# Altium schematic sheet LPEDT_revA1_bikeit_MCU_IO.SchDoc: MCU I/O
size A3; Author: Dhruva Koley; DocumentNumber: 8; Revision: 1; SheetNumber: 4; SheetTotal: 4
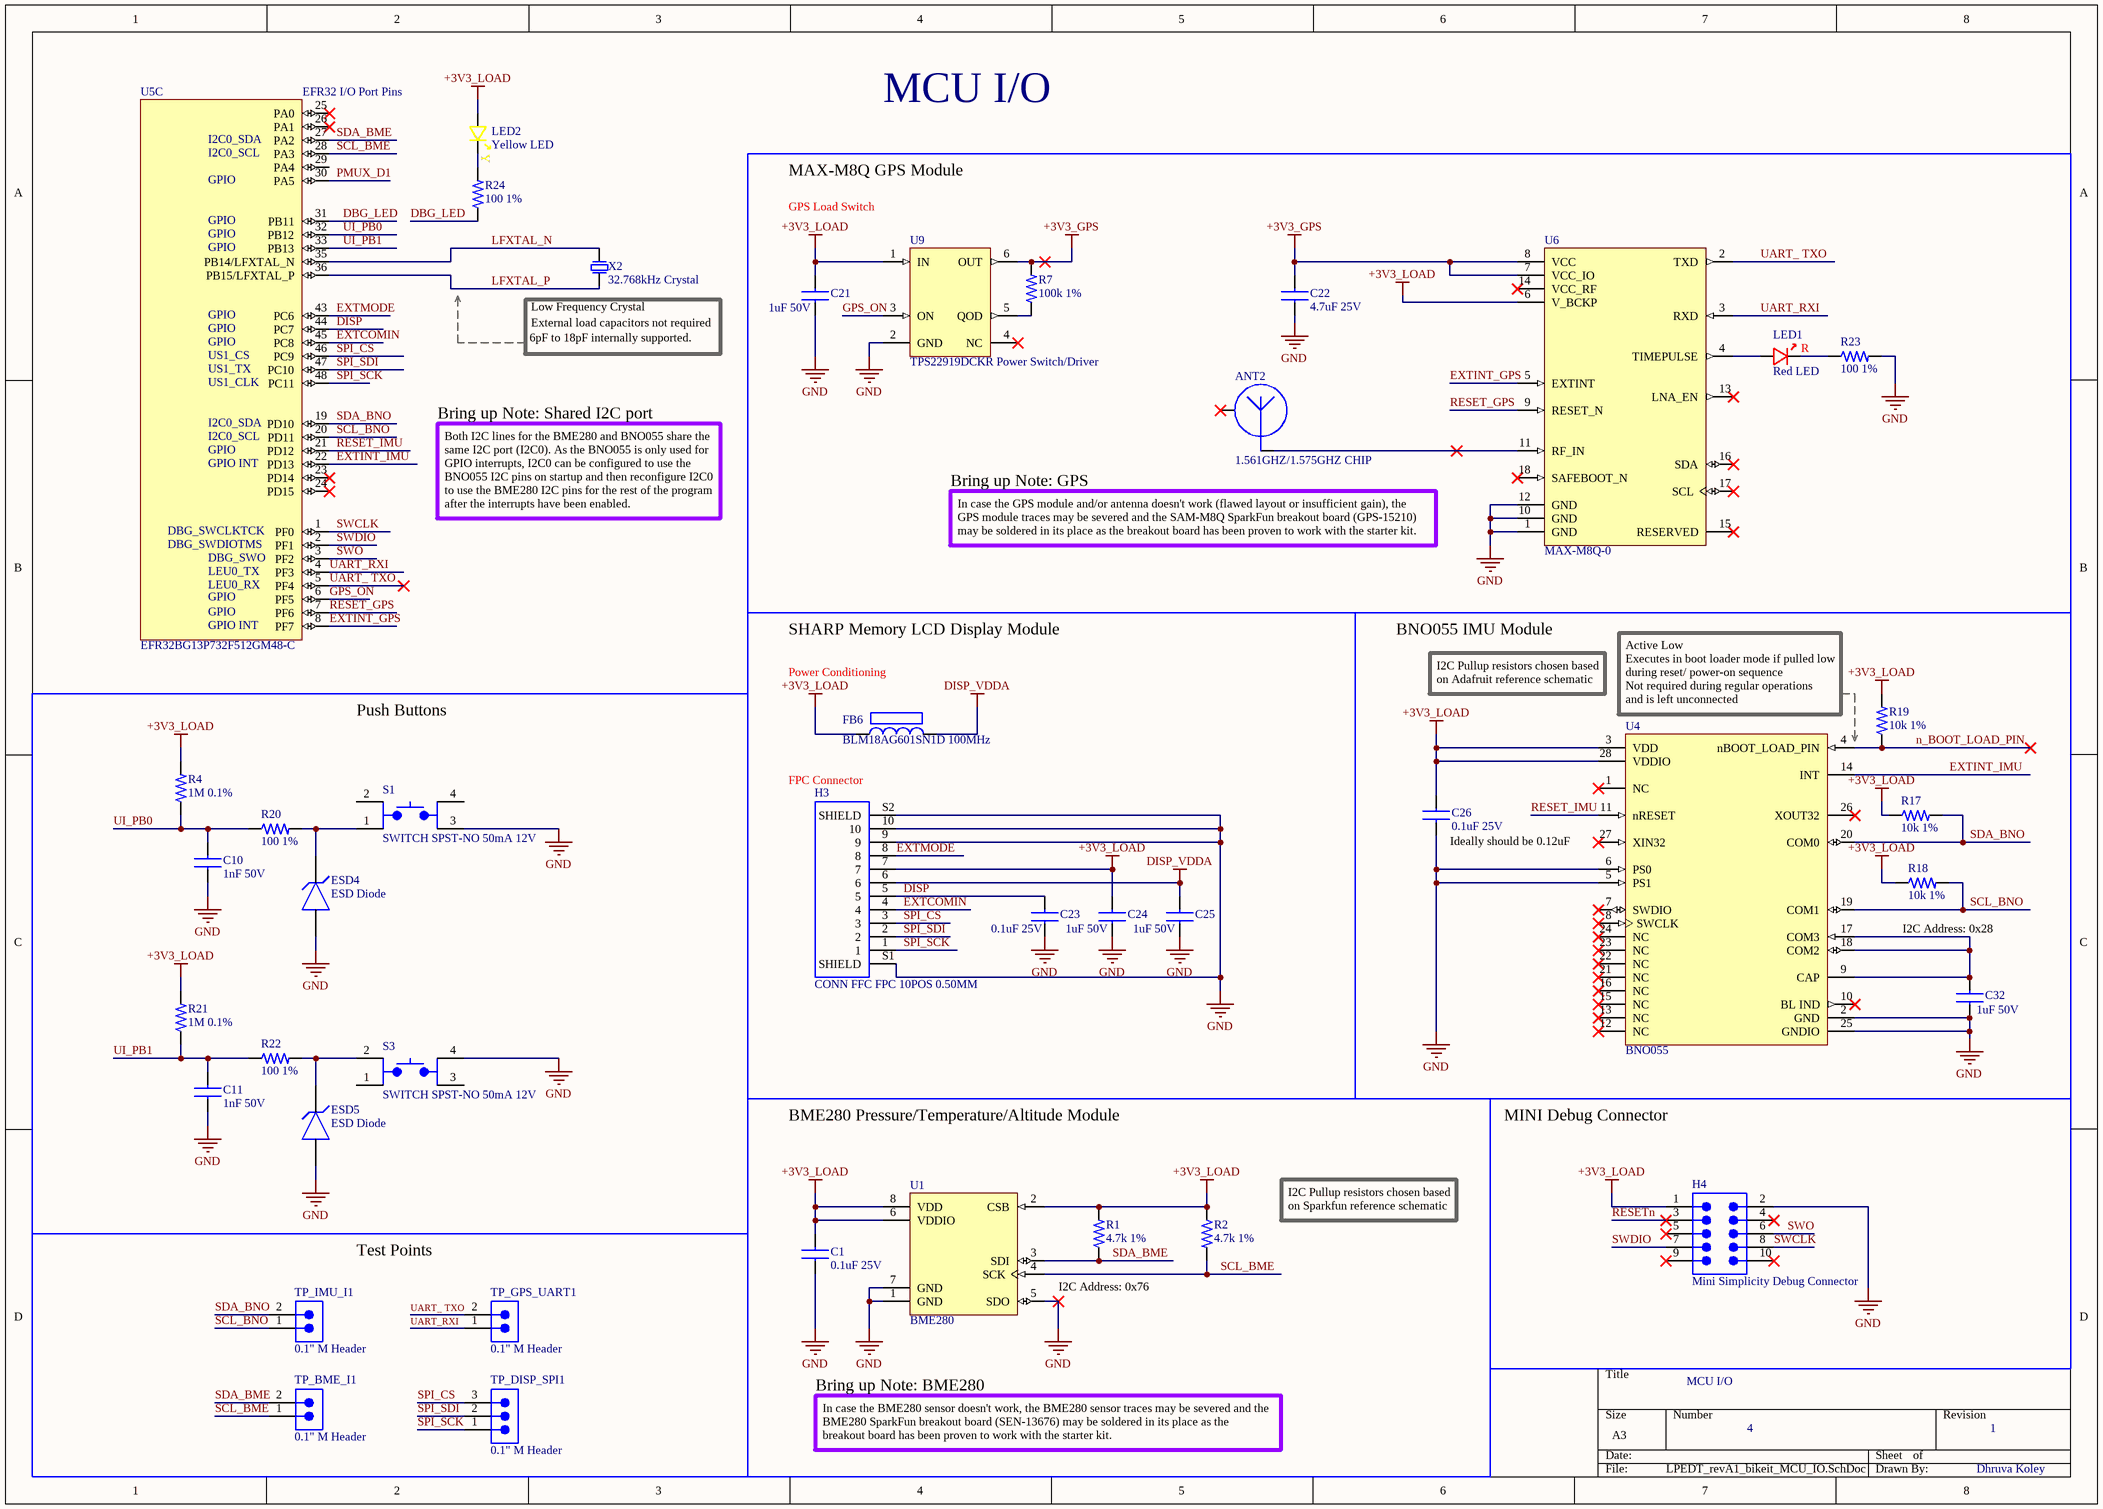
[diagram p0: LPEDT_revA1_bikeit_MCU_IO.SchDoc]

## Parts
ANT2  1.561GHZ/1.575GHZ CHIP  [CHIP_ANTENNA]
C1  0.1uF 25V  [CAP_0603_1.60mm*0.80mm]
C10  1nF 50V  [CAP_0603_1.60mm*0.80mm]
C11  1nF 50V  [CAP_0603_1.60mm*0.80mm]
C21  1uF 50V  [CAP_0603_1.60mm*0.80mm]
C22  4.7uF 25V  [CAP_0603_1.60mm*0.80mm]
C23  0.1uF 25V  [CAP_0603_1.60mm*0.80mm]
C24  1uF 50V  [CAP_0603_1.60mm*0.80mm]
C25  1uF 50V  [CAP_0603_1.60mm*0.80mm]
C26  0.1uF 25V  [CAP_0603_1.60mm*0.80mm]
C32  1uF 50V  [CAP_0603_1.60mm*0.80mm]
ESD4  ESD Diode  [ESD_SOD882]
ESD5  ESD Diode  [ESD_SOD882]
FB6  BLM18AG601SN1D 100MHz  [FB_Chip2PinSM127P600-8N]
H3  CONN FFC FPC 10POS 0.50MM  [FPC_AYF531035A]
H4  Mini Simplicity Debug Connector  [FTSH-105-01-XXX-DV-K]
LED1  Red LED  [LED_0603_RED_WL-SMCW]
LED2  Yellow LED  [LED_0603_YLW_WL-SMCW]
R1  4.7k 1%  [RES_0603_1608X06]
R2  4.7k 1%  [RES_0603_1608X06]
R4  1M 0.1%  [RES_0603_1608X06]
R7  100k 1%  [RES_0603_1608X06]
R17  10k 1%  [RES_0603_1608X06]
R18  10k 1%  [RES_0603_1608X06]
R19  10k 1%  [RES_0603_1608X06]
R20  100 1%  [RES_0603_1608X06]
R21  1M 0.1%  [RES_0603_1608X06]
R22  100 1%  [RES_0603_1608X06]
R23  100 1%  [RES_0603_1608X06]
R24  100 1%  [RES_0603_1608X06]
S1  SWITCH SPST-NO 50mA 12V  [SW_TL3305AF260QG]
S3  SWITCH SPST-NO 50mA 12V  [SW_TL3305AF260QG]
TP_BME_I1  0.1" M Header  [2-PIN_MALE_NO 3D]
TP_DISP_SPI1  0.1" M Header  [3-PIN_MALE_NO 3D]
TP_GPS_UART1  0.1" M Header  [2-PIN_MALE_NO 3D]
TP_IMU_I1  0.1" M Header  [2-PIN_MALE_NO 3D]
U1  BME280  [BME280_PSON65P250X250X100-8N]
U4  BNO055  [BNO055-MFG]
U5  EFR32BG13P732F512GM48-C  [MCU_QFN50P700X700X90_HS-49N]  (part C of 3)
U6  MAX-M8Q-0  [XCVR_MAX-M8C-0-10]
U9  TPS22919DCKR Power Switch/Driver  [LS_SOT65P210X110-6N]
X2  32.768kHz Crystal  [SMD_2 Crystal]

## Blocks framed on the sheet
Push Buttons: C10 C11 ESD4 ESD5 R4 R20-R22 S1 S3
MINI Debug Connector: H4
Test Points: TP_BME_I1 TP_DISP_SPI1 TP_GPS_UART1 TP_IMU_I1

## Nets
+3V3_GPS: C22.1 R7.2 U6.7(VCC_IO) U6.8(VCC) U9.6(OUT)
+3V3_LOAD: C1.1 C21.1 C24.1 C26.1 FB6.1 H3.7 H4.1 LED2.A R1.2 R2.1 R4.2 R17.1 R18.1 R19.2 R21.2 U1.2(CSB) U1.6(VDDIO) U1.8(VDD) U4.3(VDD) U4.28(VDDIO) U6.6(V_BCKP) U9.1(IN)
DISP_VDDA: C25.1 FB6.2 H3.6
GND: C1.2 C10.2 C11.2 C21.2 C22.2 C23.2 C24.2 C25.2 C26.2 C32.2 ESD4.2 ESD5.2 H3.9 H3.10 H3.S1(SHIELD) H3.S2(SHIELD) H4.2 R23.2 S1.3 S3.4 U1.1(GND) U1.5(SDO) U1.7(GND) U4.2(GND) U4.5(PS1) U4.6(PS0) U4.25(GNDIO) U6.1(GND) U6.10(GND) U6.12(GND) U9.2(GND)
DBG_LED: R24.1 U5.31(PB11)
DISP: C23.1 H3.5 U5.44(PC7)
EXTCOMIN: H3.4 U5.45(PC8)
EXTINT_GPS: U5.8(PF7) U6.5(EXTINT)
EXTINT_IMU: U4.14(INT) U5.22(PD13)
EXTMODE: H3.8 U5.43(PC6)
GPS_ON: U5.6(PF5) U9.3(ON)
LFXTAL_N: U5.35(PB14/LFXTAL_N) X2.2
LFXTAL_P: U5.36(PB15/LFXTAL_P) X2.1
n_BOOT_LOAD_PIN: R19.1 U4.4(nBOOT_LOAD_PIN)
PMUX_D1: U5.30(PA5)
RESET_GPS: U5.7(PF6) U6.9(RESET_N)
RESET_IMU: U4.11(nRESET) U5.21(PD12)
RESETn: H4.3
SCL_BME: R2.2 TP_BME_I1.1 U1.4(SCK) U5.28(PA3)
SCL_BNO: R18.2 TP_IMU_I1.1 U4.19(COM1) U5.20(PD11)
SDA_BME: R1.1 TP_BME_I1.2 U1.3(SDI) U5.27(PA2)
SDA_BNO: R17.2 TP_IMU_I1.2 U4.20(COM0) U5.19(PD10)
SPI_CS: H3.3 TP_DISP_SPI1.3 U5.46(PC9)
SPI_SCK: H3.1 TP_DISP_SPI1.1 U5.48(PC11)
SPI_SDI: H3.2 TP_DISP_SPI1.2 U5.47(PC10)
SWCLK: H4.8 U5.1(PF0)
SWDIO: H4.7 U5.2(PF1)
SWO: H4.6 U5.3(PF2)
UART_ TXO: TP_GPS_UART1.2 U5.5(PF4) U6.2(TXD)
UART_RXI: TP_GPS_UART1.1 U5.4(PF3) U6.3(RXD)
UI_PB0: C10.1 R4.1 R20.1 U5.32(PB12)
UI_PB1: C11.1 R21.1 R22.1 U5.33(PB13)
NetANT2_1: ANT2.1(FEED) U6.11(RF_IN)
NetC32_1: C32.1 U4.9(CAP) U4.17(COM3) U4.18(COM2)
NetESD4_1: ESD4.1 R20.2 S1.1
NetESD5_1: ESD5.1 R22.2 S3.2
NetLED1_A: LED1.A U6.4(TIMEPULSE)
NetLED1_C: LED1.C R23.1
NetLED2_C: LED2.C R24.2
NetR7_1: R7.1 U9.5(QOD)

Not connected (* = marked no-connect by the designer): ANT2 2(NC)*; H4 4* 5* 9* 10*; S1 2 4; S3 1 3; U4 1(NC)* 7(SWDIO)* 8(SWCLK)* 10(BL_IND)* 12(NC)* 13(NC)* 15(NC)* 16(NC)* 21(NC)* 22(NC)* 23(NC)* 24(NC)* 26(XOUT32)* 27(XIN32)*; U5 23(PD14)* 24(PD15)* 25(PA0)* 26(PA1)* 29(PA4); U6 13(LNA_EN)* 14(VCC_RF)* 15(RESERVED)* 16(SDA)* 17(SCL)* 18(SAFEBOOT_N)*; U9 4(NC)*

## Notes on the sheet
- (near U5) I2C0_SDA
- (near U5) I2C0_SCL
- GPIO
- MAX-M8Q GPS Module
- GPS Load Switch
- (near X2) Low Frequency Crystal
- US1_TX
- US1_CS
- 6pF to 18pF internally supported.
- External load capacitors not required
- (near U5) US1_CLK
- Bring up Note: Shared I2C port
- Both I2C lines for the BME280 and BNO055 share the
- same I2C port (I2C0). As the BNO055 is only used for
- (near U5) GPIO INT
- GPIO interrupts, I2C0 can be configured to use the
- BNO055 I2C pins on startup and then reconfigure I2C0
- to use the BME280 I2C pins for the rest of the program
- after the interrupts have been enabled.
- Bring up Note: GPS
- (near U6) In case the GPS module and/or antenna doesn't work (flawed layout or insufficient gain), the
- DBG_SWCLKTCK
- DBG_SWDIOTMS
- (near U5) DBG_SWO
- (near U5) LEU0_TX
- (near U5) LEU0_RX
- GPS module traces may be severed and the SAM-M8Q SparkFun breakout board (GPS-15210)
- (near U6) may be soldered in its place as the breakout board has been proven to work with the starter kit.
- SHARP Memory LCD Display Module
- BNO055 IMU Module
- Active Low
- Power Conditioning
- I2C Pullup resistors chosen based
- on Adafruit reference schematic
- (near R19) Executes in boot loader mode if pulled low
- during reset/ power-on sequence
- (near R19) Not required during regular operations
- (near U4) and is left unconnected
- FPC Connector
- Ideally should be 0.12uF
- I2C Address: 0x28
- BME280 Pressure/Temperature/Altitude Module
- on Sparkfun reference schematic
- I2C Address: 0x76
- Bring up Note: BME280
- In case the BME280 sensor doesn't work, the BME280 sensor traces may be severed and the
- BME280 SparkFun breakout board (SEN-13676) may be soldered in its place as the
- breakout board has been proven to work with the starter kit.
- (in symbol 150060RS75000) R
- (in symbol 150060YS75000) Y
- (in symbol EFR32BG13P732F512GM48-C, part C) EFR32 I/O Port Pins

## Library data of the parts
ANT2 = 1575AT43A0040E: RF ANT 1.561GHZ/1.575GHZ CHIP; Manufacturer: Johanson; Bandwidth: 40MHz; Impedance: 50R; Power Rating: 3W; Number of Bands: 1; Return Loss: -9.5dB; Gain: -2.5dB; Supplier 1: Digi-Key; Manufacturer Part Number: 1575AT43A0040E; RoHS: Yes; Category: RF Antennas; Stock 1: 56; Pricing 1: 1=0.84000, 10=0.75200, 25=0.71400, 100=0.58650, 250=0.54824, 500=0.48450 (USD); Mount: Surface Mount; Case/Package: SMD/SMT; Number of Pins: 2; Min Operating Temperature: -40°C; Max Operating Temperature: 85°C; Packaging: Tape and Reel; Package Quantity: 1; Max Power Dissipation: 3W; Termination: Solder; Frequency: 1.575GHz; Length: 7mm; Width: 2mm; Height: 0.031inch; Lead Free: Lead Free; ComponentLink1URL: https://datasheet.ciiva.com/2792/jti-antenna-1575at43a40-2006-09-2792227.pdf?src-supplier=Digi-Key; ComponentLink1Description: https://datasheet.ciiva.com/2792/jti-antenna-1575at43a40-2006-09-2792227.pdf?src-supplier=Digi-Key; ComponentLink2URL: https://datasheet.ciiva.com/24048/antenna-1575at43a0040-258086-24048619.pdf?src-supplier=Mouser; ComponentLink2Description: https://datasheet.ciiva.com/24048/antenna-1575at43a0040-258086-24048619.pdf?src-supplier=Mouser; ComponentLink3URL: https://datasheet.ciiva.com/4172/antenna-1575at43a0040-4172807.pdf?src-supplier=Arrow+Electronics; ComponentLink3Description: https://datasheet.ciiva.com/4172/antenna-1575at43a0040-4172807.pdf?src-supplier=Arrow+Electronics; Supplier Part Number 1: 712-1003-1-ND
C1 C23 C26 = GCJ188R71E104KA12D: CAP CER 0.1UF 25V X7R 0603; Manufacturer: Murata; Capacitance: 100nF; Tolerance: 10%; Supplier 1: Mouser; Manufacturer Part Number: GCJ188R71E104KA12D; RoHS: Yes; Category: Ceramic Capacitors; Stock 1: 1672; Pricing 1: 1=0.21000, 10=0.14900, 50=0.08480, 100=0.07030, 500=0.04928, 1000=0.04080 (USD); Mount: Surface Mount; Case/Package: 0603; Case Code (Imperial): 0603; Case Code (Metric): 1608; Min Operating Temperature: -55°C; Max Operating Temperature: 125°C; Features: Soft Termination; Packaging: Tape and Reel; Voltage Rating: 25V; Ratings: AEC-Q200; RoHS Compliant: Yes; ComponentLink1URL: http://search.murata.co.jp/Ceramy/image/img/A01X/G101/ENG/GCJ188R71E104KA12-01.pdf?src-supplier=Digi-Key; ComponentLink1Description: http://search.murata.co.jp/Ceramy/image/img/A01X/G101/ENG/GCJ188R71E104KA12-01.pdf?src-supplier=Digi-Key; Supplier Part Number 1: 81-GCJ188R71E104KA2D
C10 C11 = CL10B102KB8NNNC: Cap Ceramic 0.001uF 50V X7R 10% Pad SMD 0603 125°C T/R; Manufacturer: Samsung; Supplier 1: Digi-Key; Manufacturer Part Number: CL10B102KB8NNNC; RoHS: Yes; Category: Ceramic Capacitors; Stock 1: 2467621; Pricing 1: 4000=0.00643, 8000=0.00587 (USD); Mount: Surface Mount; Case/Package: 0603; Case Code (Metric): 1608; Case Code (Imperial): 0603; Material: Ceramic; Contact Plating: Tin; Min Operating Temperature: -55°C; Max Operating Temperature: 125°C; Tolerance: 10%; Package Quantity: 1; Packaging: Tape and Reel; Capacitance: 1nF; Voltage Rating: 50V; Dielectric: X7R; Voltage: 50V; Voltage Rating (DC): 50V; Series: CL; Construction: Flat; Length: 1.6mm; Width: 0.031inch; Height: 0.8mm; Thickness: 0.035inch; Depth: 0.8mm; Radiation Hardening: No; Lead Free: Lead Free; RoHS Compliant: Yes; ComponentLink1URL: https://datasheet.ciiva.com/25805/cl10b102kb8nnnc-25805137.pdf?src-supplier=Digi-Key; ComponentLink1Description: https://datasheet.ciiva.com/25805/cl10b102kb8nnnc-25805137.pdf?src-supplier=Digi-Key; ComponentLink2URL: https://datasheet.ciiva.com/15216/getdatasheetpartid-359690-15216231.pdf?src-supplier=Verical; ComponentLink2Description: https://datasheet.ciiva.com/15216/getdatasheetpartid-359690-15216231.pdf?src-supplier=Verical; ComponentLink3URL: https://datasheet.ciiva.com/29198/458300-da-01-en-vs-kondensator-0603-29198498.pdf?src-supplier=Conrad; ComponentLink3Description: https://datasheet.ciiva.com/29198/458300-da-01-en-vs-kondensator-0603-29198498.pdf?src-supplier=Conrad; ComponentLink4URL: https://datasheet.ciiva.com/16199/cl05b104kq5nnnc-16199064.pdf?src-supplier=Future+Electronics; ComponentLink4Description: https://datasheet.ciiva.com/16199/cl05b104kq5nnnc-16199064.pdf?src-supplier=Future+Electronics; ComponentLink5URL: https://datasheet.ciiva.com/26310/mlcc-catalogdownload2013-eng-26310326.pdf?src-supplier=Distrelec; ComponentLink5Description: https://datasheet.ciiva.com/26310/mlcc-catalogdownload2013-eng-26310326.pdf?src-supplier=Distrelec; Supplier Part Number 1: 1276-1018-2-ND
C21 C24 C25 C32 = GRT188R61H105KE13D: CAP, MLCC, AEC-Q200, X5R, 1uF, 50V, 0603; Manufacturer: Murata; Tolerance: 10%; Supplier 1: Digi-Key; Manufacturer Part Number: GRT188R61H105KE13D; RoHS: Yes; Category: Ceramic Capacitors; Stock 1: 645268; Pricing 1: 1=0.26000, 10=0.17900, 50=0.10720, 100=0.09060, 500=0.06198, 1000=0.05483 (USD); Mount: Surface Mount; Case/Package: 0603; Case Code (Metric): 1608; Case Code (Imperial): 0603; Min Operating Temperature: -55°C; Max Operating Temperature: 85°C; Packaging: Tape and Reel; Capacitance: 1uF; Voltage Rating: 50V; Dielectric: X5R; Voltage Rating (DC): 50V; Length: 0.063inch; Width: 0.031inch; Thickness: 0.035inch; Ratings: AEC-Q200; RoHS Compliant: Yes; ComponentLink1URL: http://www.farnell.com/datasheets/2165959.pdf?src-supplier=Farnell; ComponentLink1Description: http://www.farnell.com/datasheets/2165959.pdf?src-supplier=Farnell; ComponentLink2URL: http://search.murata.co.jp/Ceramy/image/img/A01X/G101/ENG/GRT188R61H105KE13-01.pdf?src-supplier=Digi-Key; ComponentLink2Description: http://search.murata.co.jp/Ceramy/image/img/A01X/G101/ENG/GRT188R61H105KE13-01.pdf?src-supplier=Digi-Key; ComponentLink3URL: https://search.murata.co.jp/Ceramy/image/img/A01X/G101/ENG/GRT188R61H105KE13-01.pdf?src-supplier=Digi-Key; ComponentLink3Description: https://search.murata.co.jp/Ceramy/image/img/A01X/G101/ENG/GRT188R61H105KE13-01.pdf?src-supplier=Digi-Key; ComponentLink4URL: http://www.farnell.com/datasheets/2165959.pdf?src-supplier=Newark; ComponentLink4Description: http://www.farnell.com/datasheets/2165959.pdf?src-supplier=Newark; Supplier Part Number 1: 490-12330-1-ND
C22 = GRM188R61E475KE11D: Cap Ceramic 0603 4.7 uF 25 V ±10 % Tolerance X5R SMT Multilayer Ceramic Capacitor; Manufacturer: Murata; Tolerance: 10%; Supplier 1: Digi-Key; Manufacturer Part Number: GRM188R61E475KE11D; RoHS: Yes; Category: Ceramic Capacitors; Stock 1: 307528; Pricing 1: 1=0.36000, 10=0.24700, 50=0.17280, 100=0.14820, 500=0.11112, 1000=0.09384 (USD); Mount: Surface Mount; Case/Package: 0603; Case Code (Metric): 1608; Case Code (Imperial): 0603; Material: Ceramic; Min Operating Temperature: -55°C; Max Operating Temperature: 85°C; Package Quantity: 4000; Packaging: Cut Tape; Capacitance: 4.7uF; Voltage Rating: 25V; Dielectric: X5R; Voltage: 25V; Voltage Rating (DC): 25V; Series: GRM; Length: 1.6mm; Width: 0.031inch; Height: 0.8mm; Thickness: 0.031inch; Depth: 0.8mm; REACH SVHC: No SVHC; Lead Free: Lead Free; RoHS Compliant: Yes; ComponentLink1URL: https://datasheet.ciiva.com/46444/1769893-46444982.pdf?src-supplier=Element14; ComponentLink1Description: https://datasheet.ciiva.com/46444/1769893-46444982.pdf?src-supplier=Element14; ComponentLink2URL: https://datasheet.ciiva.com/46444/1769893-46444983.pdf?src-supplier=Element14; ComponentLink2Description: https://datasheet.ciiva.com/46444/1769893-46444983.pdf?src-supplier=Element14; ComponentLink3URL: https://datasheet.ciiva.com/14891/partnumbering-e-01-14891103.pdf?src-supplier=Digi-Key; ComponentLink3Description: https://datasheet.ciiva.com/14891/partnumbering-e-01-14891103.pdf?src-supplier=Digi-Key; ComponentLink4URL: https://datasheet.ciiva.com/14891/partnumbering-e-01-14891102.pdf?src-supplier=Digi-Key; ComponentLink4Description: https://datasheet.ciiva.com/14891/partnumbering-e-01-14891102.pdf?src-supplier=Digi-Key; Supplier Part Number 1: 490-7203-1-ND
ESD4 ESD5 = SP1003-01ETG: ESD Suppressor Diode TVS Uni-Dir 5V Automotive 2-Pin SOD-882 T/R; Manufacturer: Littelfuse; Reverse Breakdown Voltage: 6V; Capacitance: 30pF; Max Surge Current: 7A; Number of Unidirectional Channels: 1; Clamping Voltage: 12V; Power Line Protection: No; Polarity: Bidirectional,Unidirectional; Test Current: 1mA; Leakage Current: 100nA; Diode Type: ZENER; Supplier 1: Digi-Key; Manufacturer Part Number: SP1003-01ETG; RoHS: Yes; Category: TVS Diodes; Stock 1: 9965; Pricing 1: 1=0.45000, 10=0.35100, 100=0.21040, 500=0.19478, 1000=0.13245, 2000=0.12193, 5000=0.11686 (USD); Mount: Surface Mount; Number of Pins: 2; Min Operating Temperature: -40°C; Max Operating Temperature: 85°C; Package Quantity: 3000; Packaging: Tape and Reel; Operating Supply Voltage: 5V; Reverse Standoff Voltage: 5V; Min Breakdown Voltage: 6V; Breakdown Voltage: 5V; Number of Channels: 1; Termination: SMD/SMT; Number of Elements: 1; Peak Pulse Current: 7A; Resistor Type: Zener; Series: Automotive, AEC-Q101, SP1003, SPA®; REACH SVHC: No SVHC; Lead Free: Lead Free; RoHS Compliant: Yes; ComponentLink1URL: https://datasheet.ciiva.com/4507/littelfuse-tvs-diode-array-spa-sp1003-221268-4507734.pdf?src-supplier=Mouser; ComponentLink1Description: https://datasheet.ciiva.com/4507/littelfuse-tvs-diode-array-spa-sp1003-221268-4507734.pdf?src-supplier=Mouser; ComponentLink2URL: https://datasheet.ciiva.com/16488/littelfuse-tvs-diode-array-spa-sp1003-16488471.pdf?src-supplier=Future+Electronics; ComponentLink2Description: https://datasheet.ciiva.com/16488/littelfuse-tvs-diode-array-spa-sp1003-16488471.pdf?src-supplier=Future+Electronics; ComponentLink3URL: https://datasheet.ciiva.com/330/littelfuse-tvs-diode-array-sp1003-datasheet-pdf-330594.pdf?src-supplier=Digi-Key; ComponentLink3Description: https://datasheet.ciiva.com/330/littelfuse-tvs-diode-array-sp1003-datasheet-pdf-330594.pdf?src-supplier=Digi-Key; ComponentLink4URL: https://datasheet.ciiva.com/330/littelfuse-tvs-diode-array-sp1003-datasheet-pdf-330595.pdf?src-supplier=Digi-Key; ComponentLink4Description: https://datasheet.ciiva.com/330/littelfuse-tvs-diode-array-sp1003-datasheet-pdf-330595.pdf?src-supplier=Digi-Key; ComponentLink5URL: https://datasheet.ciiva.com/330/littelfuse-tvs-diode-array-sp1003-datasheet-pdf-330596.pdf?src-supplier=Digi-Key; ComponentLink5Description: https://datasheet.ciiva.com/330/littelfuse-tvs-diode-array-sp1003-datasheet-pdf-330596.pdf?src-supplier=Digi-Key; ComponentLink6URL: https://datasheet.ciiva.com/1268/1854133-1268499.pdf?src-supplier=Element14; ComponentLink6Description: https://datasheet.ciiva.com/1268/1854133-1268499.pdf?src-supplier=Element14; Supplier Part Number 1: F4088CT-ND
FB6 = BLM18AG601SN1D: Ferrite Bead, 0603 / 1608, 600 ohm, 500 mA, Série BLM18A, 0.38 ohm, ± 25%; Manufacturer: Murata; Material: Steel,Ferrite; Impedance: 600R; Max Current Rating: 500mA; Number of Lines: 1; DC Resistance (DCR): 380mR; Shielding: Unshielded; Supplier 1: Digi-Key; Manufacturer Part Number: BLM18AG601SN1D; RoHS: Yes; Category: Inductors; Stock 1: 826617; Pricing 1: 1=0.10000, 10=0.07200, 25=0.06560, 50=0.05900, 100=0.04320, 250=0.03144, 500=0.02882, 1000=0.02489 (USD); Case/Package: 0603; Number of Pins: 2; Core Material: Ferrite; Case Code (Metric): 1608; Case Code (Imperial): 0603; Weight: 7.1E-05oz; Min Operating Temperature: -55°C; Max Operating Temperature: 125°C; Package Quantity: 1; Packaging: Tape and Reel; Frequency: 100MHz; Tolerance: 25%; Current Rating: 500mA; Termination: SMD/SMT; Max DC Current: 500mA; Test Frequency: 100MHz; DC Current: 500mA; Number of Circuits: 1; Length: 1.6mm; Width: 0.8mm; Height: 0.8mm; Depth: 0.8mm; Radiation Hardening: No; RoHS Compliant: Yes; Lead Free: Lead Free; REACH SVHC: No SVHC; Military Standard: Not; ComponentLink1URL: https://datasheet.ciiva.com/19460/1844766-19460213.pdf?src-supplier=Jameco; ComponentLink1Description: https://datasheet.ciiva.com/19460/1844766-19460213.pdf?src-supplier=Jameco; ComponentLink2URL: https://datasheet.ciiva.com/29347/442309-da-01-en-chip-drossel-0603-600r-500ma-1-6x0-8mm-29347900.pdf?src-supplier=Conrad; ComponentLink2Description: https://datasheet.ciiva.com/29347/442309-da-01-en-chip-drossel-0603-600r-500ma-1-6x0-8mm-29347900.pdf?src-supplier=Conrad; ComponentLink3URL: https://datasheet.ciiva.com/41449/001172228-da-01-en-drossel-0603-600r-1-6x0-8mm-4000st-41449517.pdf?src-supplier=Conrad; ComponentLink3Description: https://datasheet.ciiva.com/41449/001172228-da-01-en-drossel-0603-600r-1-6x0-8mm-4000st-41449517.pdf?src-supplier=Conrad; ComponentLink4URL: https://datasheet.ciiva.com/1012/l0110s0100blm18a-1012017.pdf?src-supplier=Digi-Key; ComponentLink4Description: https://datasheet.ciiva.com/1012/l0110s0100blm18a-1012017.pdf?src-supplier=Digi-Key; ComponentLink5URL: https://datasheet.ciiva.com/1012/l0110s0100blm18a-1012018.pdf?src-supplier=Digi-Key; ComponentLink5Description: https://datasheet.ciiva.com/1012/l0110s0100blm18a-1012018.pdf?src-supplier=Digi-Key; ComponentLink6URL: https://datasheet.ciiva.com/1012/l0110s0100blm18a-1012019.pdf?src-supplier=Digi-Key; ComponentLink6Description: https://datasheet.ciiva.com/1012/l0110s0100blm18a-1012019.pdf?src-supplier=Digi-Key; ComponentLink7URL: https://datasheet.ciiva.com/1466/1756147-1466933.pdf?src-supplier=Element14; ComponentLink7Description: https://datasheet.ciiva.com/1466/1756147-1466933.pdf?src-supplier=Element14; ComponentLink8URL: https://datasheet.ciiva.com/1466/1756147-1466934.pdf?src-supplier=Element14; ComponentLink8Description: https://datasheet.ciiva.com/1466/1756147-1466934.pdf?src-supplier=Element14; ComponentLink9URL: https://datasheet.ciiva.com/16210/l0110s0100blm18a-16210006.pdf?src-supplier=Future+Electronics; ComponentLink9Description: https://datasheet.ciiva.com/16210/l0110s0100blm18a-16210006.pdf?src-supplier=Future+Electronics; ComponentLink10URL: https://datasheet.ciiva.com/3081/l0110s0100blm18a-3081613.pdf?src-supplier=Avnet; ComponentLink10Description: https://datasheet.ciiva.com/3081/l0110s0100blm18a-3081613.pdf?src-supplier=Avnet; Supplier Part Number 1: 490-1014-1-ND
H3 = AYF531035A: 10 Position 0.5 mm Solder Right Angle FFC / FPC SMD Socket; Manufacturer: Panasonic; Actuator Material: Polymer,Liquid Crystal Polymer; Voltage Rating: 50V; Current Rating: 500mA; Number of Positions: 10; Pitch: 0.02inch; Manufacturer Part Number: AYF531035A; RoHS: Yes; Category: FFC / FPC; Stock 1: 2493; Pricing 1: 1=0.93000, 10=0.81600, 25=0.76800, 50=0.73600, 100=0.70400, 250=0.64000, 500=0.57600, 1000=0.51200, 2500=0.46400 (USD); Mount: Surface Mount; Contact Plating: Gold; Contact Material: Copper Alloy; Housing Material: Polymer; Min Operating Temperature: -55°C; Max Operating Temperature: 85°C; Package Quantity: 500; Packaging: Cut Strip; Termination: Solder; Lead Free: Lead Free; Flammability Rating: UL94 V-0; ComponentLink1URL: https://www3.panasonic.biz/ac/e_download/control/connector/fpc-ffc/catalog/con_eng_y5bw.pdf?src-supplier=Digi-Key; ComponentLink1Description: https://www3.panasonic.biz/ac/e_download/control/connector/fpc-ffc/catalog/con_eng_y5bw.pdf?src-supplier=Digi-Key; ComponentLink2URL: http://www3.panasonic.biz/ac/e_download/control/connector/fpc-ffc/catalog/con_eng_y5bw.pdf?src-supplier=Digi-Key; ComponentLink2Description: http://www3.panasonic.biz/ac/e_download/control/connector/fpc-ffc/catalog/con_eng_y5bw.pdf?src-supplier=Digi-Key; Supplier 1: Digi-Key; Supplier Part Number 1: 255-5667-ND
H4 = FTSH-105-01-LM-DV-K: Conn Unshrouded Header HDR 10 POS 1.27mm Solder ST SMD Tube; Manufacturer: Samtec; Gender: Male; Number of Contacts: 10; Supplier 1: Digi-Key; Manufacturer Part Number: FTSH-105-01-LM-DV-K; RoHS: Yes; Category: Connectors; Stock 1: 2459; Pricing 1: 1=2.93000, 10=2.81700, 100=2.34750, 500=1.99536, 1000=1.70192, 5000=1.52586 (USD); Housing Material: Polymer; Housing Color: Black; Contact Plating: Gold; Contact Material: Bronze; Min Operating Temperature: -55°C; Max Operating Temperature: 125°C; Orientation: Straight; Number of Rows: 2; Packaging: Rail/Tube; Termination: Solder; Length: 6.35mm; Pitch: 1.27mm; Depth: 3.43mm; Radiation Hardening: No; ComponentLink1URL: https://datasheet.ciiva.com/16689/ftsh-mt-16689356.pdf?src-supplier=Avnet+Europe; ComponentLink1Description: https://datasheet.ciiva.com/16689/ftsh-mt-16689356.pdf?src-supplier=Avnet+Europe; ComponentLink2URL: https://datasheet.ciiva.com/10245/ftsh-mt-10245149.pdf?src-supplier=Avnet; ComponentLink2Description: https://datasheet.ciiva.com/10245/ftsh-mt-10245149.pdf?src-supplier=Avnet; Supplier Part Number 1: SAM9441-ND
LED1 = 150060RS75000: WURTH ELEKTRONIK - 150060RS75000 - LED, Red, 625 nm, 2 V, 30 mA, 250 mcd RoHS Compliant: Yes; Manufacturer: Wurth Electronics; Viewing Angle: 140°; Lens Style: Clear,Rectangular; Luminous Intensity: 250mcd; Forward Current: 30mA; Forward Voltage: 2V; Wavelength: 625nm; Test Current: 20mA; Manufacturer Part Number: 150060RS75000; RoHS: Yes; Category: LEDs; Stock 1: 173130; Pricing 1: 1=0.14000, 50=0.13300, 100=0.11400, 500=0.09990 (USD); Mount: Surface Mount; Case/Package: 0603; Color: Red; Case Code (Metric): 1608; Case Code (Imperial): 0603; Min Operating Temperature: -40°C; Max Operating Temperature: 85°C; Package Quantity: 1; Packaging: Cut Tape; Dominant Wavelength: 625nm; Length: 1.6mm; Width: 0.8mm; Height: 0.7mm; REACH SVHC: Unknown; RoHS Compliant: Yes; ComponentLink1URL: https://datasheet.ciiva.com/29563/150060rs75000-29563040.pdf?src-supplier=Digi-Key; ComponentLink1Description: https://datasheet.ciiva.com/29563/150060rs75000-29563040.pdf?src-supplier=Digi-Key; ComponentLink2URL: https://datasheet.ciiva.com/29279/759428-da-01-en-chipled-0603-w-kl-rot-150060rs75000-29279196.pdf?src-supplier=Conrad; ComponentLink2Description: https://datasheet.ciiva.com/29279/759428-da-01-en-chipled-0603-w-kl-rot-150060rs75000-29279196.pdf?src-supplier=Conrad; Supplier 1: Digi-Key; Supplier Part Number 1: 732-4978-1-ND
LED2 = 150060YS75000: WURTH ELEKTRONIK - 150060YS75000 - LED, Yellow, SMD, 0603, 30 mA, 2 V, 590 nm; Manufacturer: Wurth Electronics; Viewing Angle: 140°; Lens Style: Clear,Rectangular; Wavelength: 590nm; Luminous Intensity: 120mcd; Forward Voltage: 2V; Forward Current: 30mA; Test Current: 20mA; Manufacturer Part Number: 150060YS75000; RoHS: Yes; Category: LEDs; Stock 1: 44523; Pricing 1: 1=0.14000, 50=0.13300, 100=0.11400, 500=0.09990 (USD); Mount: Surface Mount; Case/Package: 0603; Color: Yellow; Case Code (Metric): 1608; Case Code (Imperial): 0603; Min Operating Temperature: -40°C; Max Operating Temperature: 85°C; Package Quantity: 4000; Packaging: Tape and Reel; Dominant Wavelength: 590nm; Length: 1.6mm; Width: 0.8mm; Height: 0.7mm; REACH SVHC: Unknown; RoHS Compliant: Yes; ComponentLink1URL: https://datasheet.ciiva.com/23843/150060ys75000-23843250.pdf?src-supplier=Newark; ComponentLink1Description: https://datasheet.ciiva.com/23843/150060ys75000-23843250.pdf?src-supplier=Newark; ComponentLink2URL: https://datasheet.ciiva.com/29279/759432-da-01-en-chipled-0603-w-kl-gelb-150060ys75000-29279206.pdf?src-supplier=Conrad; ComponentLink2Description: https://datasheet.ciiva.com/29279/759432-da-01-en-chipled-0603-w-kl-gelb-150060ys75000-29279206.pdf?src-supplier=Conrad; ComponentLink3URL: https://datasheet.ciiva.com/29563/150060ys75000-29563045.pdf?src-supplier=Digi-Key; ComponentLink3Description: https://datasheet.ciiva.com/29563/150060ys75000-29563045.pdf?src-supplier=Digi-Key; ComponentLink4URL: https://datasheet.ciiva.com/22656/1911348-22656951.pdf?src-supplier=Element14; ComponentLink4Description: https://datasheet.ciiva.com/22656/1911348-22656951.pdf?src-supplier=Element14; ComponentLink5URL: https://datasheet.ciiva.com/29563/150060ys75000-29563033.pdf?src-supplier=Digi-Key; ComponentLink5Description: https://datasheet.ciiva.com/29563/150060ys75000-29563033.pdf?src-supplier=Digi-Key; ComponentLink6URL: https://datasheet.ciiva.com/48430/150060ys75000-eng-tds-48430044.pdf?src-supplier=Distrelec; ComponentLink6Description: https://datasheet.ciiva.com/48430/150060ys75000-eng-tds-48430044.pdf?src-supplier=Distrelec; Supplier 1: Digi-Key; Supplier Part Number 1: 732-4981-1-ND
R1 R2 = RC0603FR-074K7L: RES SMD 4.7k  1% 0603; Manufacturer: Yageo; Resistance: 4.7kR; Voltage Rating (DC): 50V; Temperature Coefficient: 100ppm/°C; Power Rating: 100mW; Supplier 1: Digi-Key; Manufacturer Part Number: RC0603FR-074K7L; RoHS: Yes; Category: Chip SMD Resistors; Stock 1: 3174335; Pricing 1: 1=0.10000, 10=0.02300, 100=0.00930, 1000=0.00417, 2500=0.00362 (USD); Case/Package: 0603; Number of Pins: 2; Case Code (Imperial): 0603; Case Code (Metric): 1608; Size Code: 0603; Min Operating Temperature: -55°C; Max Operating Temperature: 155°C; Packaging: Tape and Reel; Tolerance: 1%; Resistor Type: Thick Film; Voltage Rating: 50V; Termination: SMD/SMT; Features: Moisture Resistant; Series: RC; Max Power Dissipation: 100mW; Number of Terminations: 2; Construction: Rectangular; Resistance Tolerance: 1%; Length: 1.6mm; Width: 0.8mm; Height: 0.45mm; Depth: 0.8mm; Lead Pitch: 0.3mm; REACH SVHC: No SVHC; Lead Free: Lead Free; Military Standard: Not; RoHS Compliant: Yes; ComponentLink1URL: https://datasheet.ciiva.com/15189/getdatasheetpartid-422754-15189760.pdf?src-supplier=Verical; ComponentLink1Description: https://datasheet.ciiva.com/15189/getdatasheetpartid-422754-15189760.pdf?src-supplier=Verical; ComponentLink2URL: https://datasheet.ciiva.com/22747/443971-22747528.pdf?src-supplier=Element14; ComponentLink2Description: https://datasheet.ciiva.com/22747/443971-22747528.pdf?src-supplier=Element14; ComponentLink3URL: https://datasheet.ciiva.com/7660/38590-7660794.pdf?src-supplier=Element14; ComponentLink3Description: https://datasheet.ciiva.com/7660/38590-7660794.pdf?src-supplier=Element14; ComponentLink4URL: https://datasheet.ciiva.com/7746/1868787-7746365.pdf?src-supplier=Element14; ComponentLink4Description: https://datasheet.ciiva.com/7746/1868787-7746365.pdf?src-supplier=Element14; ComponentLink5URL: https://datasheet.ciiva.com/46440/1868787-46440909.pdf?src-supplier=Element14; ComponentLink5Description: https://datasheet.ciiva.com/46440/1868787-46440909.pdf?src-supplier=Element14; ComponentLink6URL: https://datasheet.ciiva.com/7746/1738695-7746366.pdf?src-supplier=Element14; ComponentLink6Description: https://datasheet.ciiva.com/7746/1738695-7746366.pdf?src-supplier=Element14; Supplier Part Number 1: 311-4.70KHRCT-ND
R4 R21 = CPF0603B1M0E1: Res Thin Film 0603 1M Ohm 0.1% 1/16W ±25ppm/°C Molded SMD SMD Paper T/R; Manufacturer: TE Connectivity Neohm; Resistance: 1MR; Max Power Dissipation: 63mW; Voltage Rating: 50V; Number of Resistors: 1; Supplier 1: Digi-Key; Manufacturer Part Number: CPF0603B1M0E1; RoHS: Yes; Category: Chip SMD Resistors; Stock 1: 104463; Pricing 1: 1=0.59000, 10=0.42100, 100=0.21890 (USD); Mount: Surface Mount; Case/Package: 0603; Case Code (Imperial): 0603; Case Code (Metric): 1608; Weight: 7.1E-05oz; Size Code: 0603; Min Operating Temperature: -55°C; Max Operating Temperature: 155°C; Packaging: Tape and Reel; Tolerance: 0.1%; Resistor Type: Thin Film; Package Quantity: 1000; Temperature Coefficient: 25ppm/°C; Number of Terminations: 2; Series: CPF, Neohm; Power Rating: 63mW; Termination: Solder; Voltage Rating (DC): 50V; Resistance Tolerance: 0.1%; Length: 1.55mm; Width: 0.8mm; Height: 0.45mm; Lead Free: Lead Free; RoHS Compliant: Yes; REACH SVHC: No SVHC; ELV: Compliant; ComponentLink1URL: https://datasheet.ciiva.com/12793/eng-ds-1773200-i-12793711.pdf?src-supplier=Mouser; ComponentLink1Description: https://datasheet.ciiva.com/12793/eng-ds-1773200-i-12793711.pdf?src-supplier=Mouser; ComponentLink2URL: https://datasheet.ciiva.com/22670/1723857-22670697.pdf?src-supplier=Element14; ComponentLink2Description: https://datasheet.ciiva.com/22670/1723857-22670697.pdf?src-supplier=Element14; ComponentLink3URL: https://datasheet.ciiva.com/46382/1723857-46382668.pdf?src-supplier=Element14; ComponentLink3Description: https://datasheet.ciiva.com/46382/1723857-46382668.pdf?src-supplier=Element14; Supplier Part Number 1: A102234CT-ND
R7 = RC0603FR-07100KL: RES SMD 100k  1% 1/10W 0603; Manufacturer: Yageo; Resistance: 100kR; Temperature Coefficient: 100ppm/°C; Voltage Rating (DC): 50V; Power Rating: 100mW; Working Voltage: 75V; Supplier 1: Digi-Key; Manufacturer Part Number: RC0603FR-07100KL; RoHS: Yes; Category: Chip SMD Resistors; Stock 1: 21765991; Pricing 1: 1=0.10000, 10=0.02300, 100=0.00930, 1000=0.00417, 2500=0.00362 (USD); Case/Package: 0603; Number of Pins: 2; Case Code (Imperial): 0603; Case Code (Metric): 1608; Min Operating Temperature: -55°C; Max Operating Temperature: 155°C; Tolerance: 1%; Packaging: Tape and Reel; Resistor Type: Thick Film; Voltage Rating: 50V; Termination: SMD/SMT; Number of Terminations: 2; Features: Moisture Resistant; Series: RC; Max Power Dissipation: 100mW; Resistance Tolerance: 1%; Construction: Rectangular; Technology: THICK FILM; Length: 1.6mm; Width: 0.8mm; Height: 0.45mm; Depth: 0.8mm; REACH SVHC: No SVHC; Lead Free: Lead Free; Military Standard: Not; RoHS Compliant: Yes; ComponentLink1URL: https://datasheet.ciiva.com/11808/0900766b80f96399-11808107.pdf?src-supplier=RSComponents; ComponentLink1Description: https://datasheet.ciiva.com/11808/0900766b80f96399-11808107.pdf?src-supplier=RSComponents; ComponentLink2URL: https://datasheet.ciiva.com/46440/1868787-46440889.pdf?src-supplier=Element14; ComponentLink2Description: https://datasheet.ciiva.com/46440/1868787-46440889.pdf?src-supplier=Element14; ComponentLink3URL: https://datasheet.ciiva.com/7746/1738695-7746234.pdf?src-supplier=Element14; ComponentLink3Description: https://datasheet.ciiva.com/7746/1738695-7746234.pdf?src-supplier=Element14; ComponentLink4URL: https://datasheet.ciiva.com/7983/443971-7983593.pdf?src-supplier=Element14; ComponentLink4Description: https://datasheet.ciiva.com/7983/443971-7983593.pdf?src-supplier=Element14; ComponentLink5URL: https://datasheet.ciiva.com/7746/1738695-7746235.pdf?src-supplier=Element14; ComponentLink5Description: https://datasheet.ciiva.com/7746/1738695-7746235.pdf?src-supplier=Element14; ComponentLink6URL: https://datasheet.ciiva.com/22747/443971-22747516.pdf?src-supplier=Element14; ComponentLink6Description: https://datasheet.ciiva.com/22747/443971-22747516.pdf?src-supplier=Element14; Supplier Part Number 1: 311-100KHRCT-ND
R17-R19 = RC0603FR-0710KL: RES SMD 10k 1% 1/10W 0603; Manufacturer: Yageo; Resistance: 10kR; Temperature Coefficient: 100ppm/°C; Voltage Rating (DC): 50V; Power Rating: 100mW; Voltage Rating: 75V; Supplier 1: Digi-Key; Manufacturer Part Number: RC0603FR-0710KL; RoHS: Yes; Category: Chip SMD Resistors; Stock 1: 20705079; Pricing 1: 1=0.10000, 10=0.02300, 100=0.00930, 1000=0.00417, 2500=0.00362 (USD); Case/Package: 0603; Number of Pins: 2; Case Code (Imperial): 0603; Case Code (Metric): 1608; Size Code: 0603; Weight: 7.1E-05oz; Min Operating Temperature: -55°C; Max Operating Temperature: 155°C; Packaging: Tape and Reel; Tolerance: 1%; Resistor Type: Thick Film; Termination: SMD/SMT; Features: Moisture Resistant; Series: RC; Max Power Dissipation: 100mW; Number of Terminations: 2; Resistance Tolerance: 1%; Construction: Rectangular; Length: 1.6mm; Width: 0.8mm; Height: 0.45mm; Depth: 0.8mm; Lead Pitch: 0.3mm; REACH SVHC: Unknown; Lead Free: Lead Free; Military Standard: Not; RoHS Compliant: Yes; ComponentLink1URL: https://datasheet.ciiva.com/7660/38590-7660789.pdf?src-supplier=Element14; ComponentLink1Description: https://datasheet.ciiva.com/7660/38590-7660789.pdf?src-supplier=Element14; ComponentLink2URL: https://datasheet.ciiva.com/15189/getdatasheetpartid-409289-15189591.pdf?src-supplier=Verical; ComponentLink2Description: https://datasheet.ciiva.com/15189/getdatasheetpartid-409289-15189591.pdf?src-supplier=Verical; ComponentLink3URL: https://datasheet.ciiva.com/46440/1868787-46440891.pdf?src-supplier=Element14; ComponentLink3Description: https://datasheet.ciiva.com/46440/1868787-46440891.pdf?src-supplier=Element14; ComponentLink4URL: https://datasheet.ciiva.com/7983/443971-7983596.pdf?src-supplier=Element14; ComponentLink4Description: https://datasheet.ciiva.com/7983/443971-7983596.pdf?src-supplier=Element14; ComponentLink5URL: https://datasheet.ciiva.com/7746/1738695-7746239.pdf?src-supplier=Element14; ComponentLink5Description: https://datasheet.ciiva.com/7746/1738695-7746239.pdf?src-supplier=Element14; ComponentLink6URL: https://datasheet.ciiva.com/22747/443971-22747519.pdf?src-supplier=Element14; ComponentLink6Description: https://datasheet.ciiva.com/22747/443971-22747519.pdf?src-supplier=Element14; Supplier Part Number 1: 311-10.0KHRCT-ND
R20 R22-R24 = RMCF0603FT100R: RES SMD 100 1%; Manufacturer: Stackpole Electronics; Resistance: 100R; Power Rating: 100mW; Temperature Coefficient: 100ppm/°C; Supplier 1: Digi-Key; Manufacturer Part Number: RMCF0603FT100R; RoHS: Yes; Category: Chip SMD Resistors; Stock 1: 1363320; Pricing 1: 1=0.10000, 10=0.01600, 100=0.00650, 1000=0.00292, 2500=0.00253 (USD); Mount: Surface Mount; Case/Package: 0603; Case Code (Metric): 1608; Case Code (Imperial): 0603; Contact Plating: Tin,Matte; Size Code: 0603; Min Operating Temperature: -55°C; Max Operating Temperature: 155°C; Tolerance: 1%; Packaging: Tape and Reel; Resistor Type: Thick Film; Number of Terminations: 2; Max Power Dissipation: 100mW; Features: Automotive AEC-Q200; Series: RMCF; Construction: Rectangular; Length: 1.55mm; Width: 0.031inch; Height: 0.022inch; Depth: 0.8mm; Radiation Hardening: No; Military Standard: Not; Lead Free: Lead Free; RoHS Compliant: Yes; ComponentLink1URL: https://datasheet.ciiva.com/15215/getdatasheetpartid-360413-15215981.pdf?src-supplier=Verical; ComponentLink1Description: https://datasheet.ciiva.com/15215/getdatasheetpartid-360413-15215981.pdf?src-supplier=Verical; Supplier Part Number 1: RMCF0603FT100RCT-ND
S1 S3 = TL3305AF260QG: SWITCH TACTILE SPST-NO 50MA 12V; Manufacturer: E-Switch; Mechanical Life: 200000Cycles; Throw Configuration: SPST; Illumination Type: Non-Illuminated; Operating Force: 260gf; Switch Function: Off-Mom; Actuator Type: Standard; Switch Travel: 0.2mm; Manufacturer Part Number: TL3305AF260QG; RoHS: No; Category: Tactile Switches; Stock 1: 70002; Pricing 1: 1=0.18000, 10=0.17700, 25=0.16760, 100=0.15250, 250=0.14336, 500=0.13116, 1000=0.10980 (USD); Mount: Surface Mount; Min Operating Temperature: -20°C; Max Operating Temperature: 70°C; Packaging: Tape and Reel; Termination: Gull Wing; Lead Free: Lead Free; ComponentLink1URL: http://www.farnell.com/datasheets/2554191.pdf?src-supplier=Farnell; ComponentLink1Description: http://www.farnell.com/datasheets/2554191.pdf?src-supplier=Farnell; ComponentLink2URL: http://www.farnell.com/datasheets/2554191.pdf?src-supplier=Newark; ComponentLink2Description: http://www.farnell.com/datasheets/2554191.pdf?src-supplier=Newark; ComponentLink3URL: http://www.farnell.com/datasheets/2554191.pdf?src-supplier=Element14; ComponentLink3Description: http://www.farnell.com/datasheets/2554191.pdf?src-supplier=Element14; ComponentLink4URL: http://spec_sheets.e-switch.com/specs/P010471.pdf?src-supplier=Digi-Key; ComponentLink4Description: http://spec_sheets.e-switch.com/specs/P010471.pdf?src-supplier=Digi-Key; ComponentLink5URL: http://spec_sheets.e-switch.com/specs/P010471.pdf?src-supplier=Mouser; ComponentLink5Description: http://spec_sheets.e-switch.com/specs/P010471.pdf?src-supplier=Mouser; ComponentLink6URL: http://spec_sheets.e-switch.com/specs/P010471.pdf?src-supplier=NAC+Semi; ComponentLink6Description: http://spec_sheets.e-switch.com/specs/P010471.pdf?src-supplier=NAC+Semi; Supplier 1: Digi-Key; Supplier Part Number 1: EG5353CT-ND
TP_BME_I1 TP_GPS_UART1 TP_IMU_I1 = PRPC002SAAN-RC_1: CONN HEADER VERT 2POS 2.54MM; Manufacturer: Sullins; Connector Type: Header, Unshrouded, Breakaway; Number of Positions: 2; Number of Positions Loaded: All; Pitch: 0.100" (2.54mm); Online Catalog: 0.100" (2.54mm) Pitch Connector Headers; Other Names: S9510E-02  S9510E-02-ND; Supplier 1: Digi-Key; Manufacturer Part Number: PRPC002SAAN-RC; Stock 1: 42739; Pricing 1: 1=0.08, 10=0.073, 25=0.054, 50=0.0464, 100=0.0449, 250=0.0387, 500=0.0372 (USD); Standard Package: 1; Category: Connectors, Interconnects; Family: Rectangular Connectors - Headers, Male Pins; Series: -; Packaging: Bulk; Contact Type: Male Pin; Number of Rows: 1; Row Spacing: -; Contact Mating Length: 0.230" (5.84mm); Mounting Type: Through Hole; Termination: Solder; Fastening Type: -; Features: -; Contact Finish: Gold; Contact Finish Thickness: Flash; Color: Black; ComponentLink1URL: https://media.digikey.com/PDF/Data%20Sheets/Sullins%20PDFs/xRxCzzzSxxN-RC_ST_11635-B.pdf?src-supplier=Digi-Key; ComponentLink1Description: https://media.digikey.com/PDF/Data%20Sheets/Sullins%20PDFs/xRxCzzzSxxN-RC_ST_11635-B.pdf?src-supplier=Digi-Key; Supplier Part Number 1: S1011EC-02-ND
TP_DISP_SPI1 = PRPC003SAAN-RC_1: CONN HEADER VERT 3POS 2.54MM; Manufacturer: Sullins; Connector Type: Header, Unshrouded, Breakaway; Number of Positions: 3; Number of Positions Loaded: All; Pitch: 0.100" (2.54mm); Online Catalog: 0.100" (2.54mm) Pitch Connector Headers; Other Names: S9510E-03  S9510E-03-ND; Supplier 1: Digi-Key; Manufacturer Part Number: PRPC003SAAN-RC; Stock 1: 19067; Pricing 1: 1=0.12, 10=0.109, 25=0.0812, 50=0.0696, 100=0.0673, 250=0.058, 500=0.0557 (USD); Standard Package: 1; Category: Connectors, Interconnects; Family: Rectangular Connectors - Headers, Male Pins; Series: -; Packaging: Bulk; Contact Type: Male Pin; Number of Rows: 1; Row Spacing: -; Contact Mating Length: 0.230" (5.84mm); Mounting Type: Through Hole; Termination: Solder; Fastening Type: -; Features: -; Contact Finish: Gold; Contact Finish Thickness: Flash; Color: Black; ComponentLink1URL: https://media.digikey.com/PDF/Data%20Sheets/Sullins%20PDFs/xRxCzzzSxxN-RC_ST_11635-B.pdf?src-supplier=Digi-Key; ComponentLink1Description: https://media.digikey.com/PDF/Data%20Sheets/Sullins%20PDFs/xRxCzzzSxxN-RC_ST_11635-B.pdf?src-supplier=Digi-Key; Supplier Part Number 1: S1011EC-03-ND
U1 = BME280: Humidity Temperature Sensor 0 ~ 100% RH I²C, SPI ±3% 1s Surface Mount; MF: Bosch; Price: None; Package: LGA-8 Bosch; Value: *; MP: BME280; Availability: Unavailable; SnapEDA_Link: https://www.snapeda.com/parts/BME280/Bosch%20Sensortec/view-part/49769/?ref=snap; Supplier 1: Digi-Key; Supplier Part Number 1: 828-1063-1-ND
U4 = BNO055: IMU ACCEL/GYRO/MAG I2C 28LGA / CMP-2000-05075-4; Sensor Type: Accelerometer; Packaging: Tape and Reel; Case/Package: LGA; Min Operating Temperature: -40°C; Mount: Surface Mount; Output Type: I2C; Lead Free: Lead Free; Max Operating Temperature: 85°C
U5 = EFR32BG13P732F512GM48-C: BLUE GECKO QFN48 2.4 GHZ 512KB 6; Manufacturer: Silicon Labs; Supplier 1: Digi-Key; Manufacturer Part Number: EFR32BG13P732F512GM48-C; RoHS: No; Category: RF Receivers, Transceivers; Pricing 1: 1=7.61000, 10=6.79200, 25=6.11320, 80=5.56988, 230=5.02643, 440=4.51023, 945=3.80380 (USD); ComponentLink1URL: http://www.farnell.com/datasheets/2813683.pdf?src-supplier=Farnell; ComponentLink1Description: http://www.farnell.com/datasheets/2813683.pdf?src-supplier=Farnell; Supplier Part Number 1: 336-4109-ND
U6 = MAX-M8Q-0: MAX-M8 RF Receiver BeiDou, Galileo, GLONASS, GNSS, GPS 1.575GHz -167dBm; MF: U-Blox America; MP: MAX-M8Q-0; Availability: Warning; Check_prices: https://www.snapeda.com/parts/MAX-M8Q-0/U-Blox%20America%20Inc./view-part/563405/?ref=eda; Price: None; SnapEDA_Link: https://www.snapeda.com/parts/MAX-M8Q-0/U-Blox%20America%20Inc./view-part/563405/?ref=snap; Purchase-URL: https://pricing.snapeda.com/search/part/MAX-M8Q-0/?ref=eda; Package: SMD-18 u-blox; Value: *; Supplier 1: Digi-Key; Supplier Part Number 1: 672-MAX-M8Q-0TR-ND
U9 = TPS22919DCKR: 5.5-V, 1.5-A, 90-mΩ load switch with adj. output discharge 6-SC70 -40 to 105; Manufacturer: Texas Instruments; Supplier 1: Digi-Key; Manufacturer Part Number: TPS22919DCKR; RoHS: Yes; Stock 1: 68518; Pricing 1: 1=0.39000, 10=0.29100, 25=0.26240, 100=0.14310, 250=0.13832, 500=0.12402, 1000=0.09540 (USD); RoHS Compliant: Yes; Supplier Part Number 1: 296-TPS22919DCKRCT-ND
X2 = CM8V-T1A-32.768KHZ-12.5PF-20PPM-TB-QA: 32.768kHz ±20ppm Crystal 12.5pF 70 kOhms 2-SMD, No Lead; Manufacturer: Micro Crystal; Supplier 1: Digi-Key; Manufacturer Part Number: CM8V-T1A-32.768KHZ-12.5PF-20PPM-TB-QA; RoHS: No; Stock 1: 2694; Pricing 1: 1=0.77000, 10=0.63800, 50=0.57400, 100=0.51030, 500=0.48478 (USD); Supplier Part Number 1: 2195-CM8V-T1A-32.768KHZ-12.5PF-20PPM-TB-QACT-ND